# Altium schematic sheet LOAD_SWITCHES.SchDoc
size A3; SheetNumber: 3; SheetTotal: 4
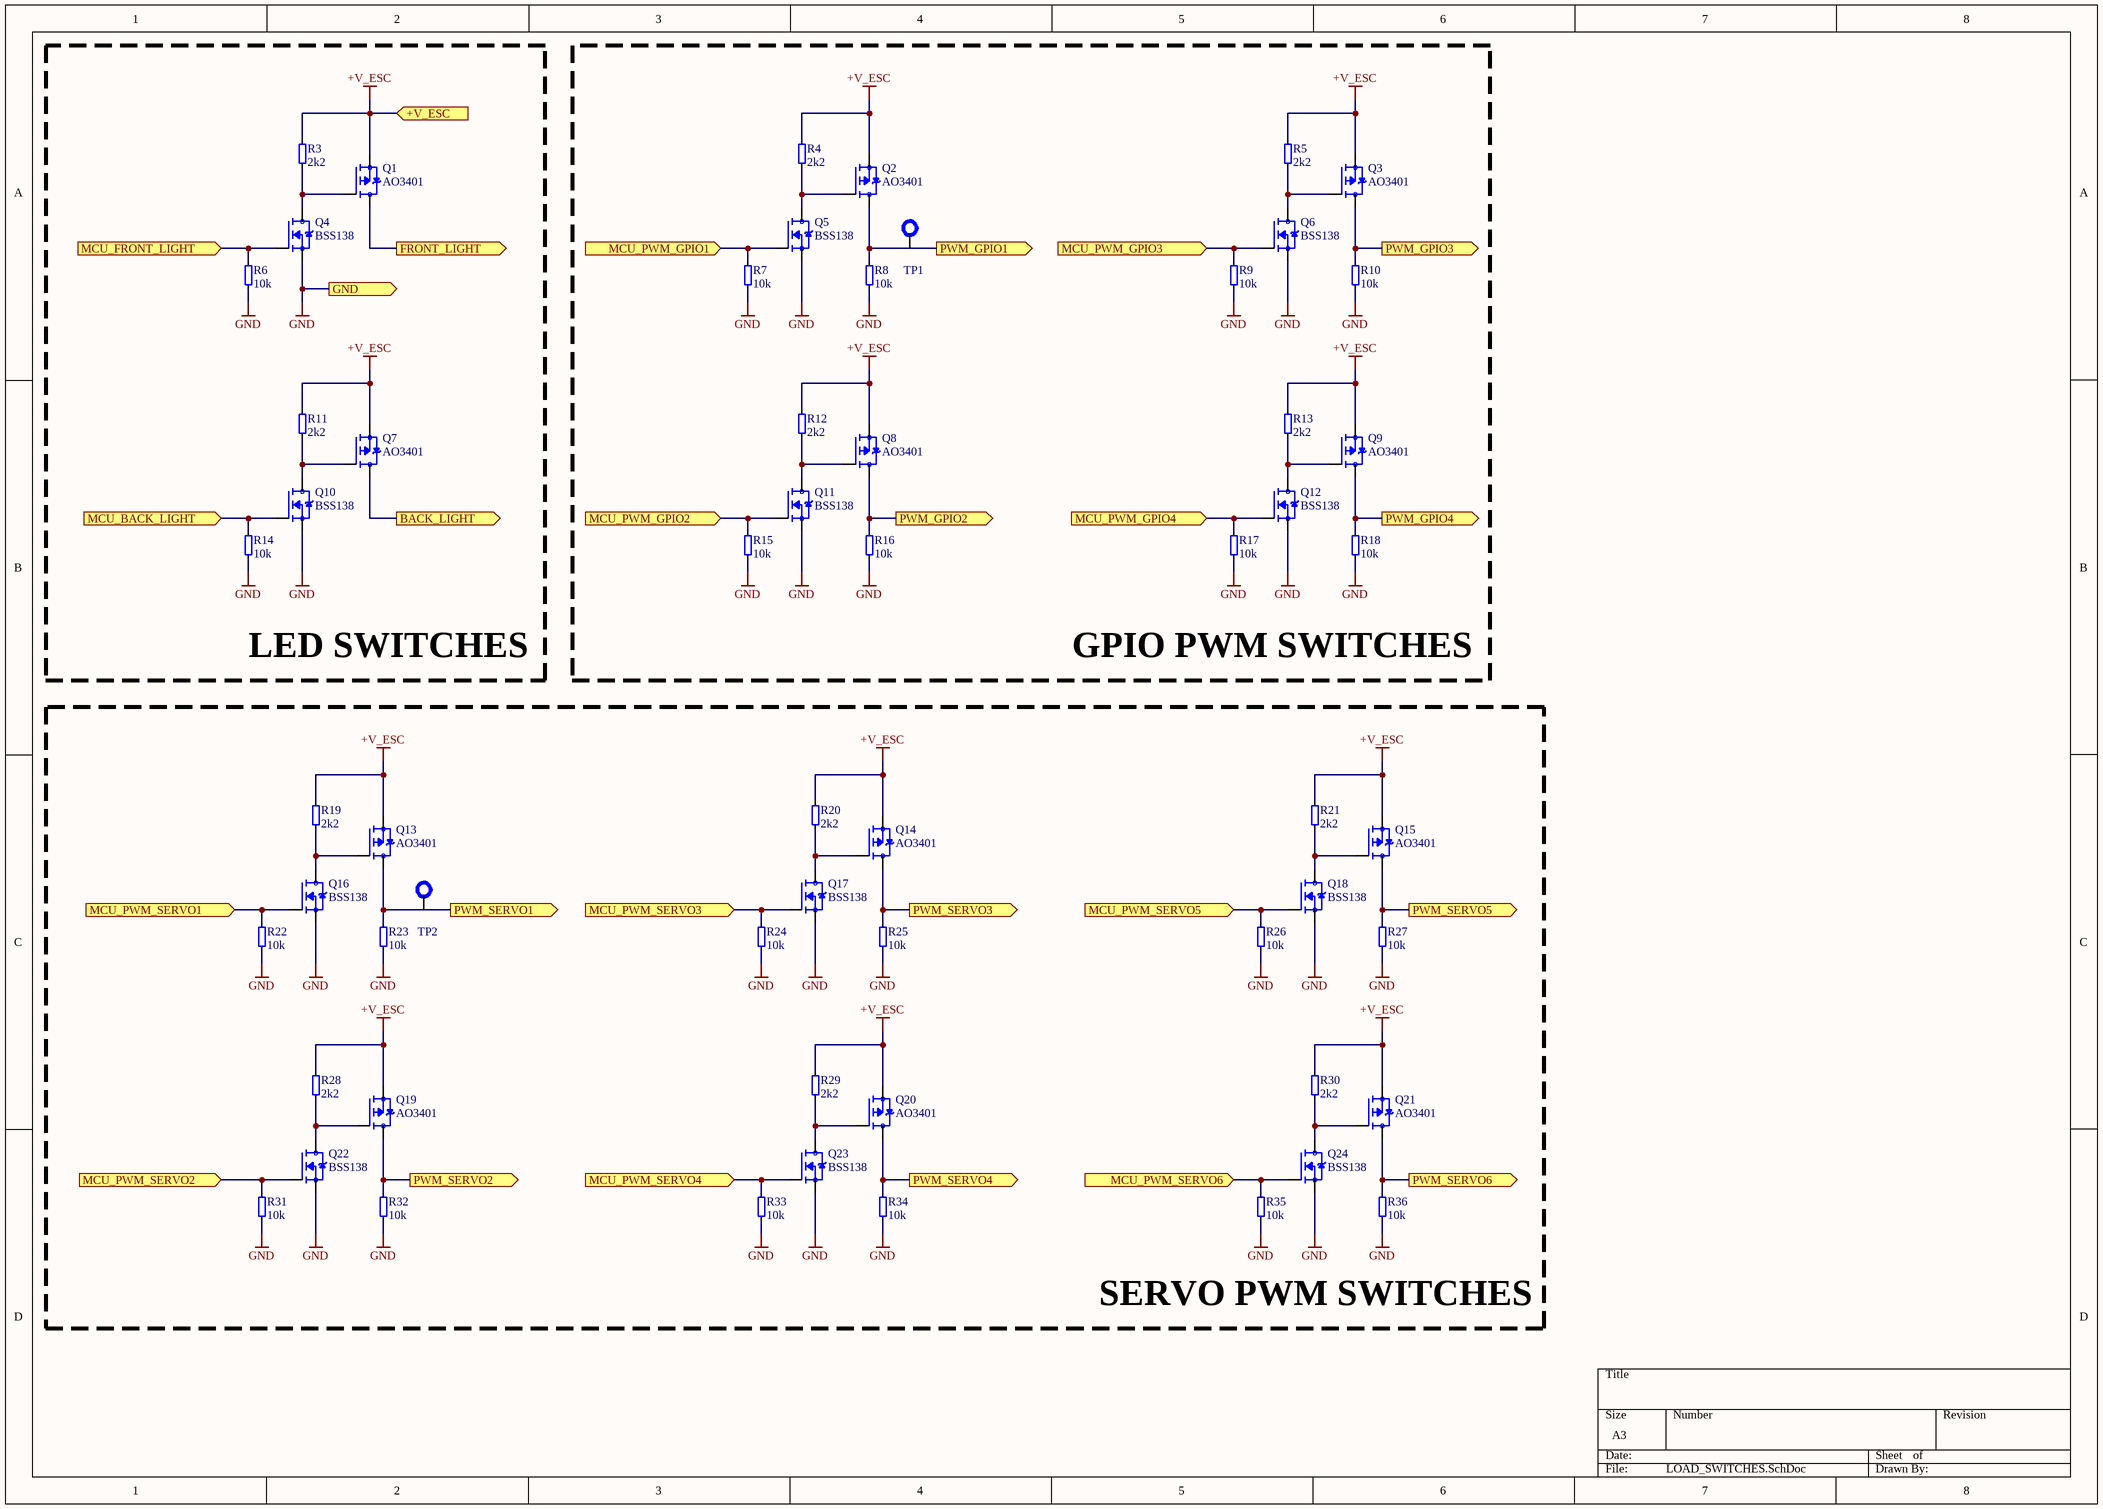
[diagram p0: LOAD_SWITCHES.SchDoc]

## Parts
Q1  AO3401  [SOT95P240X111-3N]
Q2  AO3401  [SOT95P240X111-3N]
Q3  AO3401  [SOT95P240X111-3N]
Q4  BSS138  [SOT95P240X111-3N]
Q5  BSS138  [SOT95P240X111-3N]
Q6  BSS138  [SOT95P240X111-3N]
Q7  AO3401  [SOT95P240X111-3N]
Q8  AO3401  [SOT95P240X111-3N]
Q9  AO3401  [SOT95P240X111-3N]
Q10  BSS138  [SOT95P240X111-3N]
Q11  BSS138  [SOT95P240X111-3N]
Q12  BSS138  [SOT95P240X111-3N]
Q13  AO3401  [SOT95P240X111-3N]
Q14  AO3401  [SOT95P240X111-3N]
Q15  AO3401  [SOT95P240X111-3N]
Q16  BSS138  [SOT95P240X111-3N]
Q17  BSS138  [SOT95P240X111-3N]
Q18  BSS138  [SOT95P240X111-3N]
Q19  AO3401  [SOT95P240X111-3N]
Q20  AO3401  [SOT95P240X111-3N]
Q21  AO3401  [SOT95P240X111-3N]
Q22  BSS138  [SOT95P240X111-3N]
Q23  BSS138  [SOT95P240X111-3N]
Q24  BSS138  [SOT95P240X111-3N]
R3  2k2  [R0402]
R4  2k2  [R0402]
R5  2k2  [R0402]
R6  10k  [R0402]
R7  10k  [R0402]
R8  10k  [R0402]
R9  10k  [R0402]
R10  10k  [R0402]
R11  2k2  [R0402]
R12  2k2  [R0402]
R13  2k2  [R0402]
R14  10k  [R0402]
R15  10k  [R0402]
R16  10k  [R0402]
R17  10k  [R0402]
R18  10k  [R0402]
R19  2k2  [R0402]
R20  2k2  [R0402]
R21  2k2  [R0402]
R22  10k  [R0402]
R23  10k  [R0402]
R24  10k  [R0402]
R25  10k  [R0402]
R26  10k  [R0402]
R27  10k  [R0402]
R28  2k2  [R0402]
R29  2k2  [R0402]
R30  2k2  [R0402]
R31  10k  [R0402]
R32  10k  [R0402]
R33  10k  [R0402]
R34  10k  [R0402]
R35  10k  [R0402]
R36  10k  [R0402]
TP1  TP  [TP]  (value not drawn)  (no BOM)
TP2  TP  [TP]  (value not drawn)  (no BOM)

## Blocks framed on the sheet
LED SWITCHES: Q1 Q4 Q7 Q10 R3 R6 R11 R14
GPIO PWM SWITCHES: Q2 Q3 Q5 Q6 Q8 Q9 Q11 Q12 R4 R5 R7-R10 R12 R13 R15-R18 TP1
SERVO PWM SWITCHES: Q13-Q24 R19-R36 TP2

## Ports
+V_ESC (in, see Tractor2000[6B], POWER[1A]), BACK_LIGHT (out, see Tractor2000[6B]), FRONT_LIGHT (out, see Tractor2000[6B]), GND (out, see Tractor2000[6C], MCU[1C], POWER[1A]), MCU_BACK_LIGHT (in, see Tractor2000[5B], MCU[2A]), MCU_FRONT_LIGHT (in, see Tractor2000[5B], MCU[2A]), MCU_PWM_GPIO1 (in, see Tractor2000[5B], MCU[2B]), MCU_PWM_GPIO2 (in, see Tractor2000[5B], MCU[2B]), MCU_PWM_GPIO3 (in, see Tractor2000[5B], MCU[2B]), MCU_PWM_GPIO4 (in, see Tractor2000[5B], MCU[1B]), MCU_PWM_SERVO1 (in, see Tractor2000[5B], MCU[2A]), MCU_PWM_SERVO2 (in, see Tractor2000[5B], MCU[2A]), MCU_PWM_SERVO3 (in, see Tractor2000[5B], MCU[2A]), MCU_PWM_SERVO4 (in, see Tractor2000[5B], MCU[2A]), MCU_PWM_SERVO5 (in, see Tractor2000[5B], MCU[2B]), MCU_PWM_SERVO6 (in, see Tractor2000[5B], MCU[1B]), PWM_GPIO1 (out, see Tractor2000[6B]), PWM_GPIO2 (out, see Tractor2000[6B]), PWM_GPIO3 (out, see Tractor2000[6B]), PWM_GPIO4 (out, see Tractor2000[6B]), PWM_SERVO1 (out, see Tractor2000[6B]), PWM_SERVO2 (out, see Tractor2000[6B]), PWM_SERVO3 (out, see Tractor2000[6B]), PWM_SERVO4 (out, see Tractor2000[6B]), PWM_SERVO5 (out, see Tractor2000[6B]), PWM_SERVO6 (out, see Tractor2000[6B])

## Nets
+V_ESC: Q1.3(D) Q2.3(D) Q3.3(D) Q7.3(D) Q8.3(D) Q9.3(D) Q13.3(D) Q14.3(D) Q15.3(D) Q19.3(D) Q20.3(D) Q21.3(D) R3.2 R4.2 R5.2 R11.2 R12.2 R13.2 R19.2 R20.2 R21.2 R28.2 R29.2 R30.2 ; port +V_ESC
GND: Q4.2(S) Q5.2(S) Q6.2(S) Q10.2(S) Q11.2(S) Q12.2(S) Q16.2(S) Q17.2(S) Q18.2(S) Q22.2(S) Q23.2(S) Q24.2(S) R6.1 R7.1 R8.1 R9.1 R10.1 R14.1 R15.1 R16.1 R17.1 R18.1 R22.1 R23.1 R24.1 R25.1 R26.1 R27.1 R31.1 R32.1 R33.1 R34.1 R35.1 R36.1 ; port GND
BACK_LIGHT: Q7.2(S) ; port BACK_LIGHT
FRONT_LIGHT: Q1.2(S) ; port FRONT_LIGHT
MCU_BACK_LIGHT: Q10.1(G) R14.2 ; port MCU_BACK_LIGHT
MCU_FRONT_LIGHT: Q4.1(G) R6.2 ; port MCU_FRONT_LIGHT
MCU_PWM_GPIO1: Q5.1(G) R7.2 ; port MCU_PWM_GPIO1
MCU_PWM_GPIO2: Q11.1(G) R15.2 ; port MCU_PWM_GPIO2
MCU_PWM_GPIO3: Q6.1(G) R9.2 ; port MCU_PWM_GPIO3
MCU_PWM_GPIO4: Q12.1(G) R17.2 ; port MCU_PWM_GPIO4
MCU_PWM_SERVO1: Q16.1(G) R22.2 ; port MCU_PWM_SERVO1
MCU_PWM_SERVO2: Q22.1(G) R31.2 ; port MCU_PWM_SERVO2
MCU_PWM_SERVO3: Q17.1(G) R24.2 ; port MCU_PWM_SERVO3
MCU_PWM_SERVO4: Q23.1(G) R33.2 ; port MCU_PWM_SERVO4
MCU_PWM_SERVO5: Q18.1(G) R26.2 ; port MCU_PWM_SERVO5
MCU_PWM_SERVO6: Q24.1(G) R35.2 ; port MCU_PWM_SERVO6
PWM_GPIO1: Q2.2(S) R8.2 ; port PWM_GPIO1
PWM_GPIO2: Q8.2(S) R16.2 ; port PWM_GPIO2
PWM_GPIO3: Q3.2(S) R10.2 ; port PWM_GPIO3
PWM_GPIO4: Q9.2(S) R18.2 ; port PWM_GPIO4
PWM_SERVO1: Q13.2(S) R23.2 ; port PWM_SERVO1
PWM_SERVO2: Q19.2(S) R32.2 ; port PWM_SERVO2
PWM_SERVO3: Q14.2(S) R25.2 ; port PWM_SERVO3
PWM_SERVO4: Q20.2(S) R34.2 ; port PWM_SERVO4
PWM_SERVO5: Q15.2(S) R27.2 ; port PWM_SERVO5
PWM_SERVO6: Q21.2(S) R36.2 ; port PWM_SERVO6
NetQ1_1: Q1.1(G) Q4.3(D) R3.1
NetQ2_1: Q2.1(G) Q5.3(D) R4.1
NetQ3_1: Q3.1(G) Q6.3(D) R5.1
NetQ7_1: Q7.1(G) Q10.3(D) R11.1
NetQ8_1: Q8.1(G) Q11.3(D) R12.1
NetQ9_1: Q9.1(G) Q12.3(D) R13.1
NetQ13_1: Q13.1(G) Q16.3(D) R19.1
NetQ14_1: Q14.1(G) Q17.3(D) R20.1
NetQ15_1: Q15.1(G) Q18.3(D) R21.1
NetQ19_1: Q19.1(G) Q22.3(D) R28.1
NetQ20_1: Q20.1(G) Q23.3(D) R29.1
NetQ21_1: Q21.1(G) Q24.3(D) R30.1

Not connected (* = marked no-connect by the designer): TP1 1; TP2 1

## Library data of the parts
Q1-Q3 Q7-Q9 Q13-Q15 Q19-Q21 = AO3401: P-Channel 30 V 4A Surface Mount SOT-23-3; MF: onsemi; MP: BSS138; SnapEDA_Link: https://www.snapeda.com/parts/BSS138/Onsemi/view-part/?ref=snap; Package: SOT-23-3 ON Semiconductor; Value: *; Check_prices: https://www.snapeda.com/parts/BSS138/Onsemi/view-part/?ref=eda
Q4-Q6 Q10-Q12 Q16-Q18 Q22-Q24 = BSS138: N-Channel 50 V 220mA (Ta) 350mW (Ta) Surface Mount SOT-23-3; MF: onsemi; SnapEDA_Link: https://www.snapeda.com/parts/BSS138/Onsemi/view-part/?ref=snap; Package: SOT-23-3 ON Semiconductor; Value: *; MP: BSS138; Check_prices: https://www.snapeda.com/parts/BSS138/Onsemi/view-part/?ref=eda
R3-R36 = CMP-00016-11: Generic 0402 SMD Resistor